# EAGLE schematic domino4_IPB (EAGLE 9.6.2)
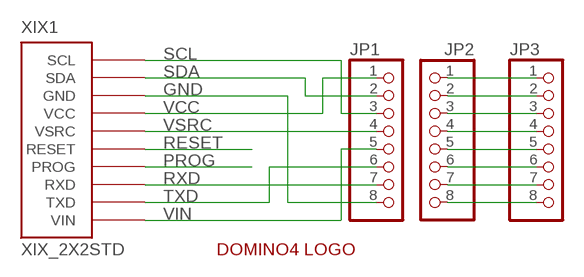
[diagram p0: schematic, sheet 1]

## Parts
JP1  PINHD-1X8  [1X08]
JP2  PINHD-1X8  [1X08]
JP3  PINHD-1X8  [1X08]
U$1  DOMINO4_LOGOHALF  [DOMINO4_LOGO_HALF]
XIX1  XIX_2X2STD  [XIX_2X2]

## Nets
GND: JP1.8 XIX1.GND@1(GND) XIX1.GND@2(GND) XIX1.GND@3(GND) XIX1.GND@4(GND)
N$1: JP2.1 JP3.1
N$2: JP2.2 JP3.2
N$3: JP2.3 JP3.3
N$4: JP2.4 JP3.4
N$5: JP2.5 JP3.5
N$6: JP2.6 JP3.6
N$7: JP2.7 JP3.7
N$8: JP2.8 JP3.8
PROG: XIX1.PROG@5(PROG) XIX1.PROG@6(PROG) XIX1.PROG@7(PROG) XIX1.PROG@8(PROG)
RESET: XIX1.RESET@5(RESET) XIX1.RESET@6(RESET) XIX1.RESET@7(RESET) XIX1.RESET@8(RESET)
RXD: JP1.7 XIX1.RXD@5(RXD) XIX1.RXD@6(RXD) XIX1.RXD@7(RXD) XIX1.RXD@8(RXD)
SCL: JP1.3 XIX1.SCL@1(SCL) XIX1.SCL@2(SCL) XIX1.SCL@3(SCL) XIX1.SCL@4(SCL)
SDA: JP1.2 XIX1.SDA@1(SDA) XIX1.SDA@2(SDA) XIX1.SDA@3(SDA) XIX1.SDA@4(SDA)
TXD: JP1.6 XIX1.TXD@5(TXD) XIX1.TXD@6(TXD) XIX1.TXD@7(TXD) XIX1.TXD@8(TXD)
VCC: JP1.1 XIX1.VCC@1(VCC) XIX1.VCC@2(VCC) XIX1.VCC@3(VCC) XIX1.VCC@4(VCC)
VIN: JP1.5 XIX1.VIN@5(VIN) XIX1.VIN@6(VIN) XIX1.VIN@7(VIN) XIX1.VIN@8(VIN)
VSRC: JP1.4 XIX1.VSRC@1(VSRC) XIX1.VSRC@2(VSRC) XIX1.VSRC@3(VSRC) XIX1.VSRC@4(VSRC)

## Library data of the parts
JP1-JP3 = pinhead:PINHD-1X8: PIN HEADER
U$1 = 24mm:DOMINO4_LOGO
XIX1 = XiX-xBUS-Rounded:XIX_2X2